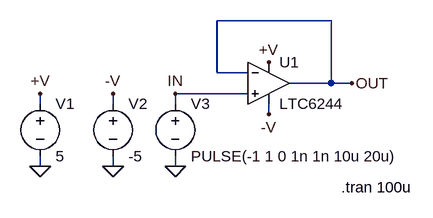
[diagram p0: schematic 6244HV.asc]
6244HV.asc, the LTspice schematic file:
Version 4
SHEET 1 880 680
WIRE 384 256 208 256
WIRE 208 336 208 256
WIRE 256 336 208 336
WIRE 384 352 384 256
WIRE 384 352 320 352
WIRE 416 352 384 352
WIRE 256 368 144 368
WIRE -64 384 -64 368
WIRE 48 384 48 368
WIRE 144 384 144 368
WIRE 288 400 288 384
WIRE -64 480 -64 464
WIRE 48 480 48 464
WIRE 144 480 144 464
FLAG -64 480 0
FLAG 48 480 0
FLAG -64 368 +V
FLAG 144 480 0
FLAG 144 368 IN
FLAG 416 352 OUT
FLAG 288 320 +V
FLAG 48 368 -V
FLAG 288 400 -V
SYMBOL voltage -64 368 R0
SYMATTR InstName V1
SYMATTR Value 5
SYMBOL voltage 48 368 R0
SYMATTR InstName V2
SYMATTR Value -5
SYMBOL LTC6244 288 352 R0
SYMATTR InstName U1
SYMBOL voltage 144 368 R0
SYMATTR InstName V3
SYMATTR Value PULSE(-1 1 0 1n 1n 10u 20u)
TEXT 400 512 Left 2 !.tran 100u

The netlist it stands for:
* 6244HV.asc
V1 +V 0 5
V2 -V 0 -5
XU1 IN OUT +V -V OUT LTC6244  ; pins In+ In- V+ V- OUT
V3 IN 0 PULSE(-1 1 0 1n 1n 10u 20u)
.tran 100u
.backanno
.end